# EAGLE schematic ARM-LPC1115_V0.08 (EAGLE 6.4)
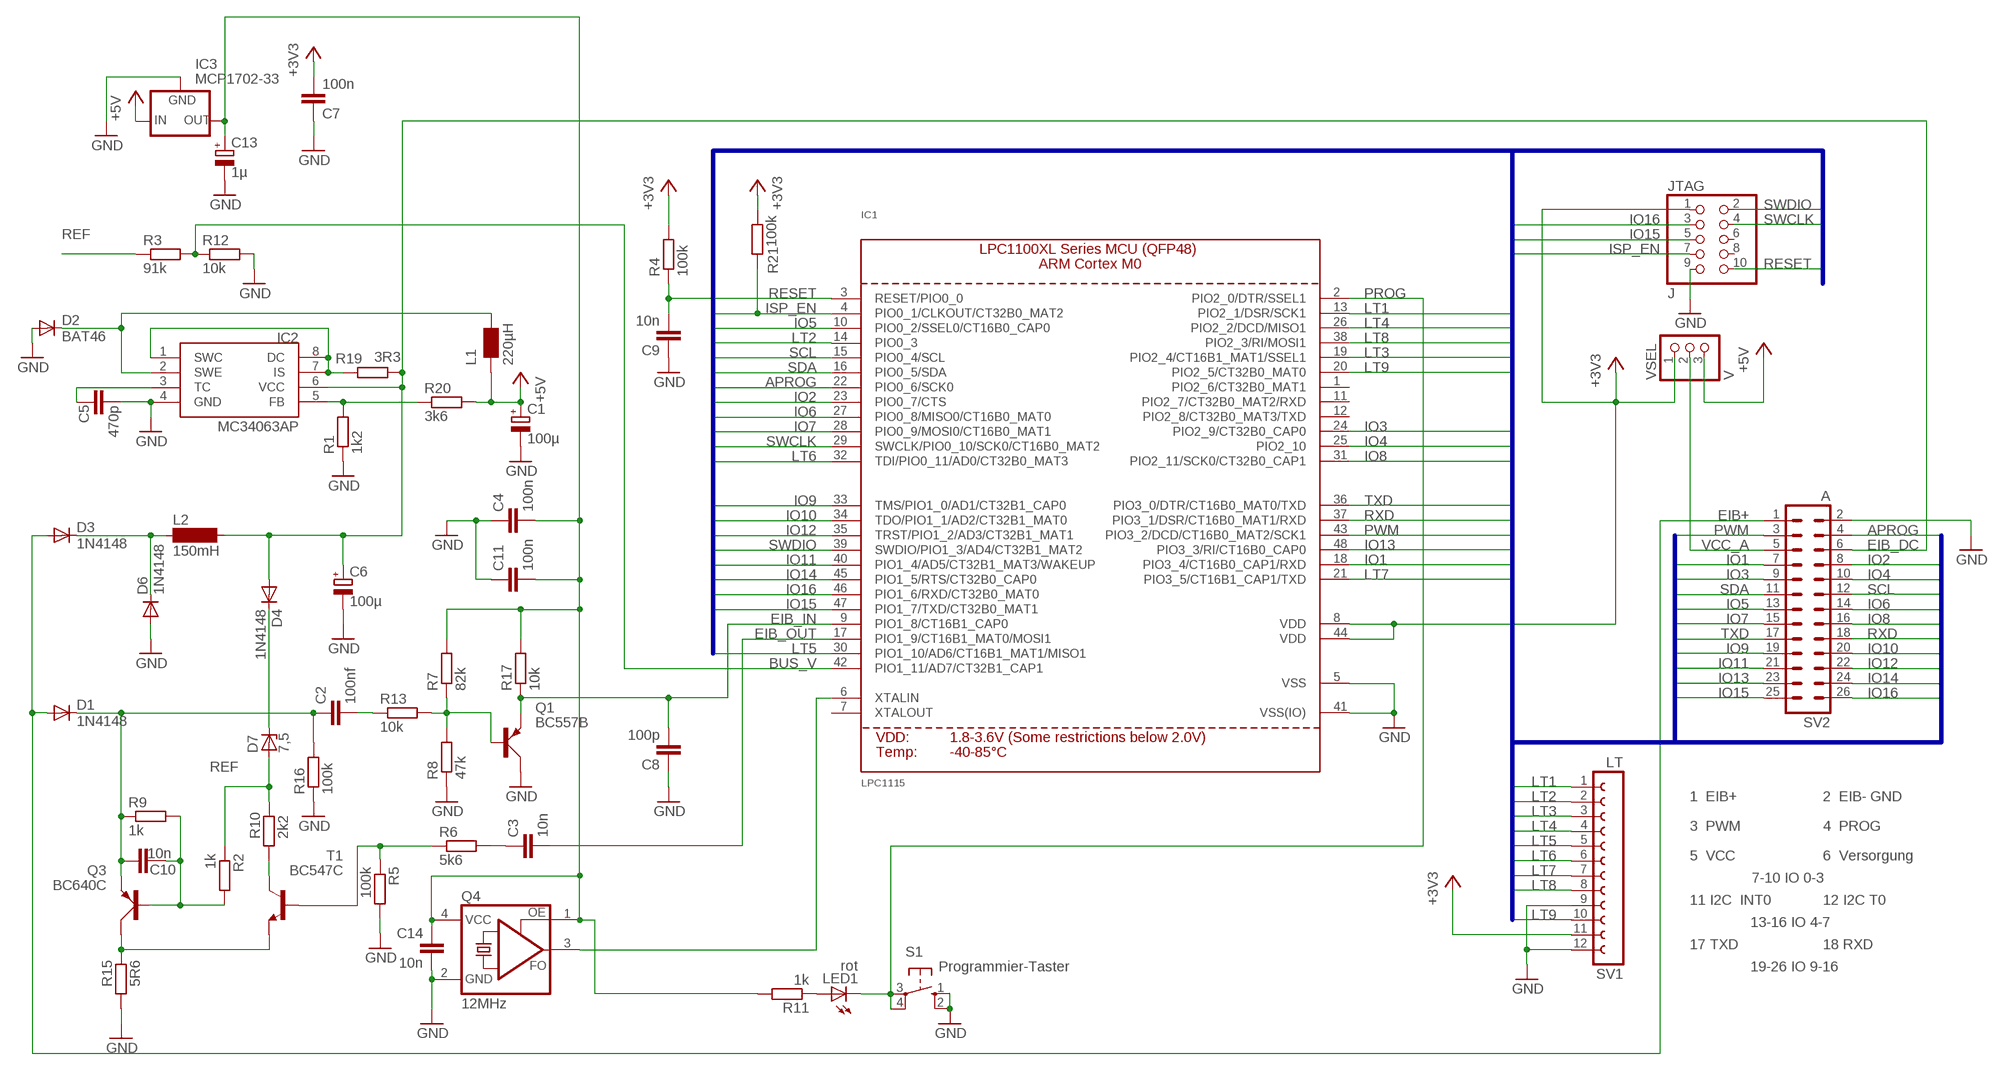
[diagram p0: schematic, sheet 1]

## Parts
C1  100µ  CPOL-EUE5-8.5  [E5-8,5]
C2  100nf  C-EU050-024X044  [C050-024X044]
C3  10n  C-EU050-024X044  [C050-024X044]
C4  100n  C-EU050-024X044  [C050-024X044]
C5  470p  C-EU025-024X044  [C025-024X044]
C6  100µ  CPOL-EUE5-8.5  [E5-8,5]
C7  100n  C-EU050-024X044  [C050-024X044]
C8  100p  C-EU050-024X044  [C050-024X044]
C9  10n  C-EU050-024X044  [C050-024X044]
C10  10n  C-EU050-024X044  [C050-024X044]
C11  100n  C-EU050-024X044  [C050-024X044]
C13  1µ  CPOL-EUE2-4  [E2-4]
C14  10n  C-EUC1206  [C1206]
D1  1N4148  DIODE-D-5  [D-5]
D2  BAT46  DIODE-C1702-05  [C1702-05]
D3  1N4148  DIODE-D-2.5  [D-2.5]
D4  1N4148  DIODE-D-5  [D-5]
D6  1N4148  DIODE-D-2.5  [D-2.5]
D7  7,5  ZENER-DIODEZD-7.5  [ZDIO-7.5]
IC1  LPC1115  LPC1113/4/5_QFP48_XLSERIES  [LQFP48]
IC2  MC34063AP  [DIL08]
IC3  MCP1702-33  79LXX  [79LXX]
JTAG  J  HEADER-2X5  [2X05]
L1  220µH  L_R85  [L_RAD_D8RM5]
L2  150mH  SD12-1000  [SD12_1000]
LED1  rot  LED3MM  [LED3MM]
Q1  BC557B  BC557  [SOT54A]
Q3  BC640C  BC640  [SOT54D]
Q4  12MHz  ASFL  [ASF]
R1  1k2  R-EU_0207/10  [0207/10]
R2  1k  R-EU_0204/7  [0204/7]
R3  91k  R-EU_0204/7  [0204/7]
R4  100k  R-EU_0204/7  [0204/7]
R5  100k  R-EU_0207/10  [0207/10]
R6  5k6  R-EU_0204/7  [0204/7]
R7  82k  R-EU_0207/7  [0207/7]
R8  47k  R-EU_0207/7  [0207/7]
R9  1k  R-EU_0204/7  [0204/7]
R10  2k2  R-EU_0204/7  [0204/7]
R11  1k  R-EU_0207/7  [0207/7]
R12  10k  R-EU_0204/7  [0204/7]
R13  10k  R-EU_0207/7  [0207/7]
R15  5R6  R-EU_0207/10  [0207/10]
R16  100k  R-EU_0207/7  [0207/7]
R17  10k  R-EU_0207/7  [0207/7]
R19  3R3  R-EU_0207/10  [0207/10]
R20  3k6  R-EU_0207/10  [0207/10]
R21  100k  R-EU_0204/7  [0204/7]
S1  Programmier-Taster  10-XX  [B3F-10XX]
SV1  LT  FE12-1  [FE12]
SV2  A  ML26  [ML26]
T1  BC547C  BC547  [TO92]
VSEL  V  HEADER-1X3ROUND  [1X03_ROUND]

## Nets
APROG: IC1.22(PIO0_6/SCK0) SV2.4
BUS_V: IC1.42(PIO1_11/AD7/CT32B1_CAP1) R3.2 R12.1
DRAIN: C2.1 C10.1 D1.C Q3.E R9.1 R16.2
EIB+: D1.A D3.A SV2.1
EIB_DC: C6.+ D4.A IC2.6(VCC) L2.2 R19.2 SV2.6
EIB_IN: C8.2 IC1.9(PIO1_8/CT16B1_CAP0) Q1.E R17.1
EIB_OUT: C3.2 IC1.17(PIO1_9/CT16B1_MAT0/MOSI1)
GND: C1.- C4.1 C5.2 C6.- C7.1 C8.1 C9.1 C11.1 C13.- C14.2 D2.A D6.A IC1.5(VSS) IC1.41(VSS(IO)) IC2.4(GND) IC3.GND JTAG.9 Q1.C Q4.2(GND) R1.1 R5.2 R8.1 R12.2 R15.1 R16.1 S1.1(S) S1.2(S1) SV1.9 SV1.12 SV2.2
IO1: IC1.18(PIO3_4/CT16B0_CAP1/RXD) SV2.7
IO2: IC1.23(PIO0_7/CTS) SV2.8
IO3: IC1.24(PIO2_9/CT32B0_CAP0) SV2.9
IO4: IC1.25(PIO2_10) SV2.10
IO5: IC1.10(PIO0_2/SSEL0/CT16B0_CAP0) SV2.13
IO6: IC1.27(PIO0_8/MISO0/CT16B0_MAT0) SV2.14
IO7: IC1.28(PIO0_9/MOSI0/CT16B0_MAT1) SV2.15
IO8: IC1.31(PIO2_11/SCK0/CT32B0_CAP1) SV2.16
IO9: IC1.33(TMS/PIO1_0/AD1/CT32B1_CAP0) SV2.19
IO10: IC1.34(TDO/PIO1_1/AD2/CT32B1_MAT0) SV2.20
IO11: IC1.40(PIO1_4/AD5/CT32B1_MAT3/WAKEUP) SV2.21
IO12: IC1.35(TRST/PIO1_2/AD3/CT32B1_MAT1) SV2.22
IO13: IC1.48(PIO3_3/RI/CT16B0_CAP0) SV2.23
IO14: IC1.45(PIO1_5/RTS/CT32B0_CAP0) SV2.24
IO15: IC1.47(PIO1_7/TXD/CT32B0_MAT1) JTAG.5 SV2.25
IO16: IC1.46(PIO1_6/RXD/CT32B0_MAT0) JTAG.3 SV2.26
ISP_EN: IC1.4(PIO0_1/CLKOUT/CT32B0_MAT2) JTAG.7 R21.1
LT1: IC1.13(PIO2_1/DSR/SCK1) SV1.1
LT2: IC1.14(PIO0_3) SV1.2
LT3: IC1.19(PIO2_4/CT16B1_MAT1/SSEL1) SV1.3
LT4: IC1.26(PIO2_2/DCD/MISO1) SV1.4
LT5: IC1.30(PIO1_10/AD6/CT16B1_MAT1/MISO1) SV1.5
LT6: IC1.32(TDI/PIO0_11/AD0/CT32B0_MAT3) SV1.6
LT7: IC1.21(PIO3_5/CT16B1_CAP1/TXD) SV1.7
LT8: IC1.38(PIO2_3/RI/MOSI1) SV1.8
LT9: IC1.20(PIO2_5/CT32B0_MAT0) SV1.10
N$1: C3.1 R6.2
N$2: C2.2 R13.1
N$3: IC2.5(FB) R1.2 R20.1
N$4: IC2.1(SWC) IC2.7(IS) IC2.8(DC) R19.1
N$6: R10.1 T1.3(C)
N$7: Q3.C R15.2 T1.1(E)
N$8: D3.C D6.C L2.1
N$9: D4.C D7.C
N$10: D2.C IC2.2(SWE) L1.1
N$12: R5.1 R6.1 T1.2(B)
N$13: C5.1 IC2.3(TC)
N$14: Q1.B R7.1 R8.2 R13.2
N$15: C10.2 Q3.B R2.2 R9.2
N$17: IC1.6(XTALIN) Q4.3(FO)
N$41: LED1.A R11.1
PROG: IC1.2(PIO2_0/DTR/SSEL1) LED1.K(C) S1.3(P) S1.4(P1)
PWM: IC1.43(PIO3_2/DCD/CT16B0_MAT2/SCK1) SV2.3
REF: D7.A R2.1 R3.1 R10.2
RESET: C9.2 IC1.3(RESET/PIO0_0) JTAG.10 R4.1
RXD: IC1.37(PIO3_1/DSR/CT16B0_MAT1/RXD) SV2.18
SCL: IC1.15(PIO0_4/SCL) SV2.12
SDA: IC1.16(PIO0_5/SDA) SV2.11
SWCLK: IC1.29(SWCLK/PIO0_10/SCK0/CT16B0_MAT2) JTAG.4
SWDIO: IC1.39(SWDIO/PIO1_3/AD4/CT32B1_MAT2) JTAG.2
TXD: IC1.36(PIO3_0/DTR/CT16B0_MAT0/TXD) SV2.17
VCC_3V3: C4.2 C7.2 C11.2 C13.+ C14.1 IC1.8(VDD) IC1.44(VDD) IC3.OUT JTAG.1 Q4.1(OE) Q4.4(VCC) R4.2 R7.2 R11.2 R17.2 R21.2 SV1.11 VSEL.1 ; supply symbol labelled +3V3
VCC_5V: C1.+ IC3.IN L1.2 R20.2 VSEL.3 ; supply symbol labelled +5V
VCC_A: SV2.5 VSEL.2
Unconnected: IC1.1(PIO2_6/CT32B0_MAT1) IC1.7(XTALOUT) IC1.11(PIO2_7/CT32B0_MAT2/RXD) IC1.12(PIO2_8/CT32B0_MAT3/TXD) JTAG.6 JTAG.8

## Buses
IO[1..16],LT[1..9],SCL,SDA,PWM,APROG,RXD,TXD,RESET,SWCLK,SWDIO,ISP_EN

## Notes on the sheet
- 1  EIB+ | 2  EIB- GND
- 3  PWM | 4  PROG
- 5  VCC | 6  Versorgung
- 7-10 IO 0-3
- 11 I2C  INT0 | 12 I2C T0
- 13-16 IO 4-7
- 17 TXD | 18 RXD
- 19-26 IO 9-16

## Library data of the parts
C1 C6 C13 = rcl:CPOL-EU: POLARIZED CAPACITOR, European symbol
C2-C5 C7-C11 C14 = rcl:C-EU: CAPACITOR, European symbol
D1-D4 D6 = diode:DIODE-: DIODE
D7 = diode:ZENER-DIODE: Z-Diode
IC1 = microbuilder:LPC1113/4/5_QFP48_XLSERIES: LPC1113/4/5 ARM Cortex M0 MCU (50MHz) - XL Series (FBD48/3x3) LPC1115FBD48/303: Max Frequency: 50MHz Flash: 64kB SRAM: 8kB ADC: 10-bit
IC2 = mc34063:MC34063
IC3 = v-reg:79LXX: VOLTAGE REGULATOR
JTAG = microbuilder:HEADER-2X5: PIN HEADER
L1 = fbctrls1:L
L2 = inductor-neosid:SD12: INDUCTOR nominal inductance
LED1 = led:LED: LED OSRAM: - CHIPLED LG R971, LG N971, LY N971, LG Q971, LY Q971, LO R971, LY R971 LH N974, LH R974 LS Q976, LO Q976, LY Q976 LO Q996 - Hyper CHIPLED LW Q18S LB Q993, LB Q99A, LB R99A - SideLED LS A670, LO A670, LY A670, LG A670, LP A670 LB A673, LV A673, LT A673, LW A673 LH A674 LY A675 LS A676, LA A676, LO A676, LY A676, LW A676 LS A679, LY A679, LG A679 - Hyper Micro SIDELED® LS Y876, LA Y876, LO Y876, LY Y876 LT Y87S - SmartLED LW L88C, LW L88S LB L89C, LB L89S, LG L890 LS L89K, LO L89K, LY L89K LS L896, LA L896, LO L896, LY L896 - TOPLED LS T670, LO T670, LY T670, LG T670, LP T670 LSG T670, LSP T670, LSY T670, LOP T670, LYG T670 LG T671, LOG T671, LSG T671 LB T673, LV T673, LT T673, LW T673 LH T674 LS T676, LA T676, LO T676, LY T676, LB T676, LH T676, LSB T676, LW T676 LB T67C, LV T67C, LT T67C, LS T67K, LO T67K, LY T67K, LW E67C LS E67B, LA E67B, LO E67B, LY E67B, LB E67C, LV E67C, LT E67C LW T67C LS T679, LY T679, LG T679 LS T770, LO T770, LY T770, LG T770, LP T770 LB T773, LV T773, LT T773, LW T773 LH T774 LS E675, LA E675, LY E675, LS T675 LS T776, LA T776, LO T776, LY T776, LB T776 LHGB T686 LT T68C, LB T68C - Hyper Mini TOPLED® LB M676 - Mini TOPLED Santana® LG M470 LS M47K, LO M47K, LY M47K Source: http://www.osram.convergy.de - LUMILED® LXK2-PW12-R00, LXK2-PW12-S00, LXK2-PW14-U00, LXK2-PW14-V00 LXK2-PM12-R00, LXK2-PM12-S00, LXK2-PM14-U00 LXK2-PE12-Q00, LXK2-PE12-R00, LXK2-PE12-S00, LXK2-PE14-T00, LXK2-PE14-U00 LXK2-PB12-K00, LXK2-PB12-L00, LXK2-PB12-M00, LXK2-PB14-N00, LXK2-PB14-P00, LXK2-PB14-Q00 LXK2-PR12-L00, LXK2-PR12-M00, LXK2-PR14-Q00, LXK2-PR14-R00 LXK2-PD12-Q00, LXK2-PD12-R00, LXK2-PD12-S00 LXK2-PH12-R00, LXK2-PH12-S00 LXK2-PL12-P00, LXK2-PL12-Q00, LXK2-PL12-R00 Source: www.luxeon.com
Q1 = transistor-small-signal:BC557: PNP TRANSISTOR
Q3 = transistor-small-signal:BC640: PNP TRANSISTOR
Q4 = crystal:ASF*: CRYSTAL CLOCK OSCILLATORS 5.0 Vdc or 3.3 Vdc - LOW PROFILE ULTRA MINIATURE CERAMIC SURFACE MOUNT Source: http://www.abracon.com/Oscillators/asf1-L-L1.pdf
R1-R13 R15-R17 R19-R21 = rcl:R-EU_: RESISTOR, European symbol
S1 = switch-omron:10-XX: OMRON SWITCH
SV1 = con-lsta:FE12-1: FEMALE HEADER; OC_FARNELL: unknown; OC_NEWARK: unknown
SV2 = con-harting-ml:ML26: HARTING; OC_FARNELL: unknown; OC_NEWARK: unknown
T1 = transistor:BC547: NPN TRANSISTOR
VSEL = microbuilder:HEADER-1X3: PIN HEADER